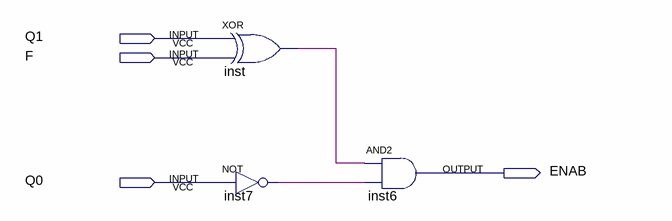
[diagram p0: schematic sheet]
// Quartus schematic victor.bdf as structural Verilog: 3 symbols, 4 pins
module victor (
  input  Q1,
  input  F,
  input  Q0,
  output ENAB
);

  wire inst7_out, inst_out;

  xor inst (inst_out, Q1, F);
  not inst7 (inst7_out, Q0);
  and inst6 (ENAB, inst_out, inst7_out);
endmodule
